# EAGLE design board3 (EAGLE 7.0.0)
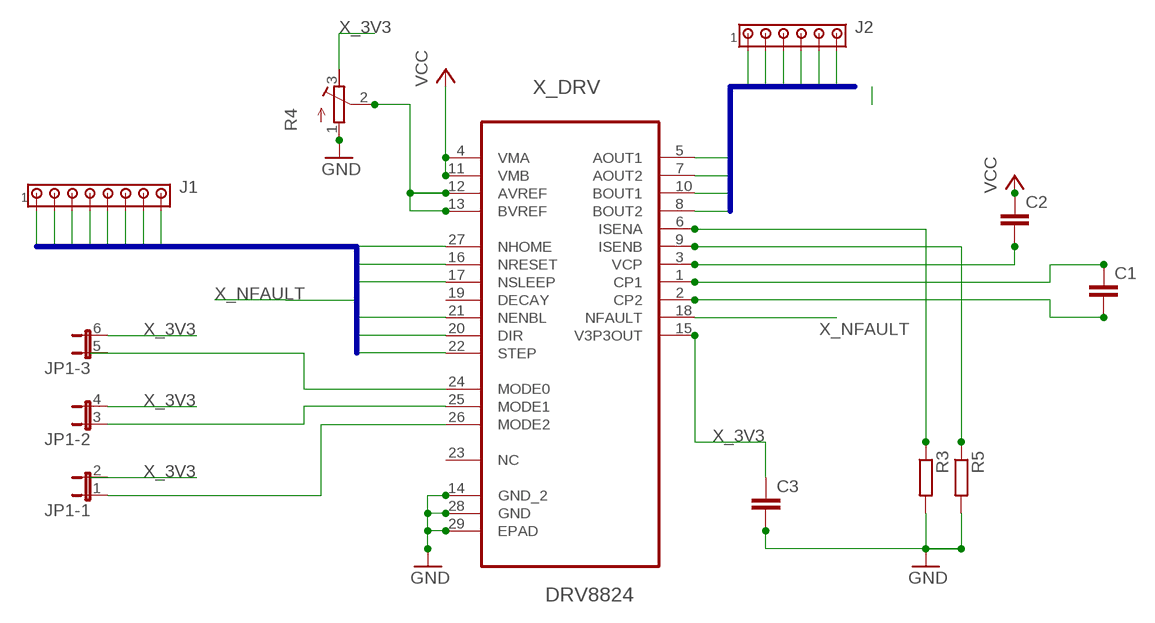
[diagram p0: schematic, sheet 1]

## Parts
C1  C-EU025-030X050  [C025-030X050]
C2  C-EU025-030X050  [C025-030X050]
C3  C-EU025-030X050  [C025-030X050]
J1  MTA08-100  [10X08MTA]
J2  MTA06-156  [1X6MTA]
JP1  JP3QE  [JP3Q]
R3  R-EU_0207/7  [0207/7]
R4  R-TRIMM64Y  [RTRIM64Y]
R5  R-EU_0207/7  [0207/7]
X_DRV  DRV8824  DRV8824PWPR  [SOP65P640X120-29N]

## Nets
GND [POWER]: C3.2 J1.8 J2.6 R3.2 R4.1(E) R5.2 X_DRV.14(GND_2) X_DRV.28(GND) X_DRV.29(EPAD)
N$1: JP1.1 X_DRV.26(MODE2)
N$2: JP1.3 X_DRV.25(MODE1)
N$3: X_DRV.24(MODE0)
N$9: R4.2(S) X_DRV.12(AVREF) X_DRV.13(BVREF)
N$10: C1.1 X_DRV.1(CP1)
N$11: C1.2 X_DRV.2(CP2)
N$12: C2.2 X_DRV.3(VCP)
N$19: R3.1 X_DRV.6(ISENA)
N$20: R5.1 X_DRV.9(ISENB)
VCC [POWER]: C2.1 J2.5 X_DRV.4(VMA) X_DRV.11(VMB)
X_3V3: C3.1 JP1.4 JP1.6 R4.3(A) X_DRV.15(V3P3OUT)
X_DIR: J1.2 X_DRV.20(DIR)
X_NENBL: J1.3 X_DRV.21(NENBL)
X_NFAULT: J1.7 X_DRV.18(NFAULT)
X_NHOME: J1.6 X_DRV.27(NHOME)
X_NRESET: J1.5 X_DRV.16(NRESET)
X_NSLEEP: J1.4 X_DRV.17(NSLEEP)
X_STEP: J1.1 X_DRV.22(STEP)
XOUT0: J2.1 X_DRV.5(AOUT1)
XOUT1: J2.2 X_DRV.7(AOUT2)
XOUT2: J2.3 J2.4 X_DRV.10(BOUT1)
XOUT3: X_DRV.8(BOUT2)
Unconnected: JP1.2 JP1.5 X_DRV.19(DECAY) X_DRV.23(NC)

## Buses
X_STEP,X_DIR,X_NENBL,X_NSLEEP,X_NRESET,X_NHOME,X_NFAULT,GND
XOUT[0..3],VCC,GND

## Library data of the parts
C1-C3 = resistor:C-EU: CAPACITOR, European symbol
J1 = con-amp:MTA08-100: AMP connector; OC_FARNELL: unknown; OC_NEWARK: unknown
J2 = con-amp:MTA06-156: AMP connector; OC_FARNELL: unknown; OC_NEWARK: unknown
JP1 = jumper:JP3QE: JUMPER
R3 R5 = resistor:R-EU_: RESISTOR, European symbol
R4 = resistor:R-TRIMM: Trimm resistor
X_DRV = ti_e14:DRV8824PWPR: STEPPER MOTOR CONTROLLER IC; MPN: DRV8824PWPR; OC_FARNELL: -; OC_NEWARK: 74R6336; PACKAGE: TSSOP-28; SUPPLIER: Texas Instruments

## Board
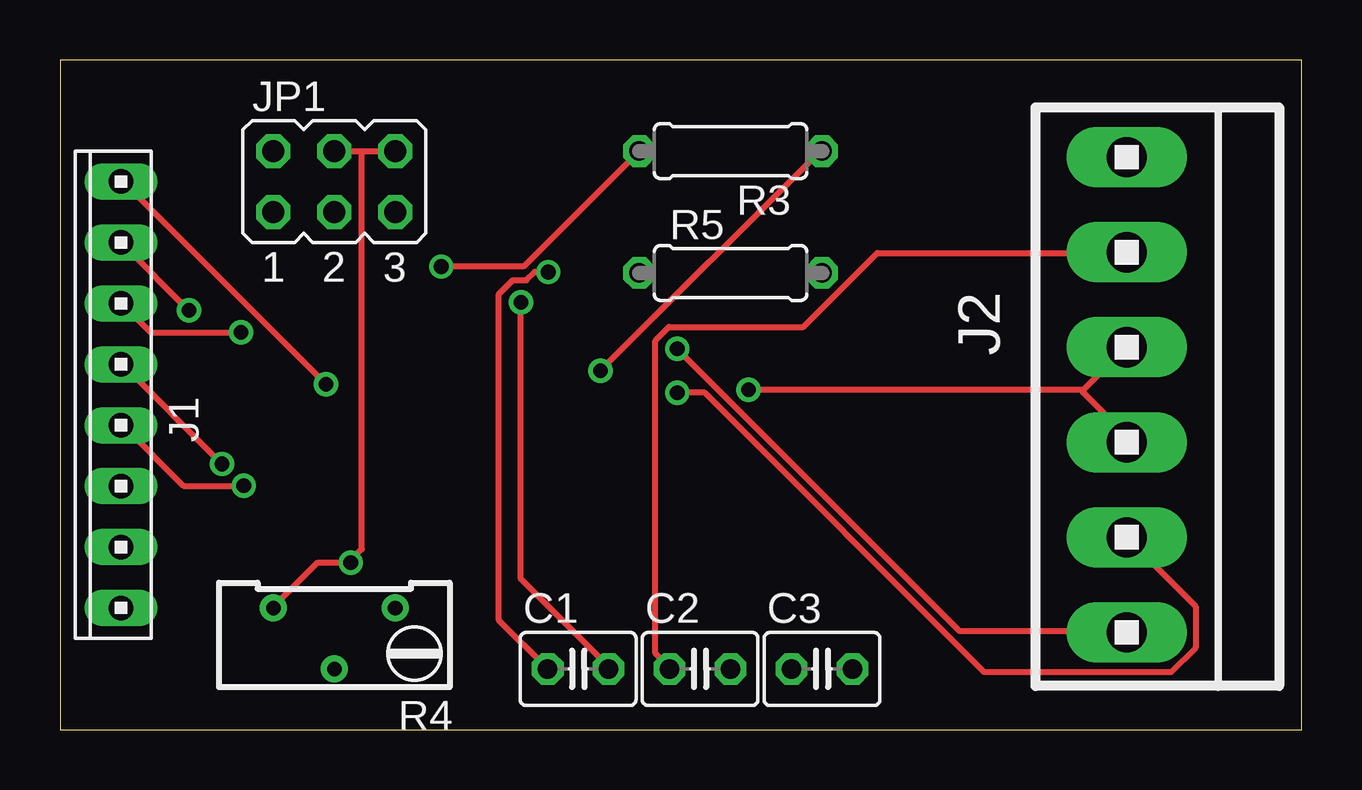
[diagram p1: board, top side]
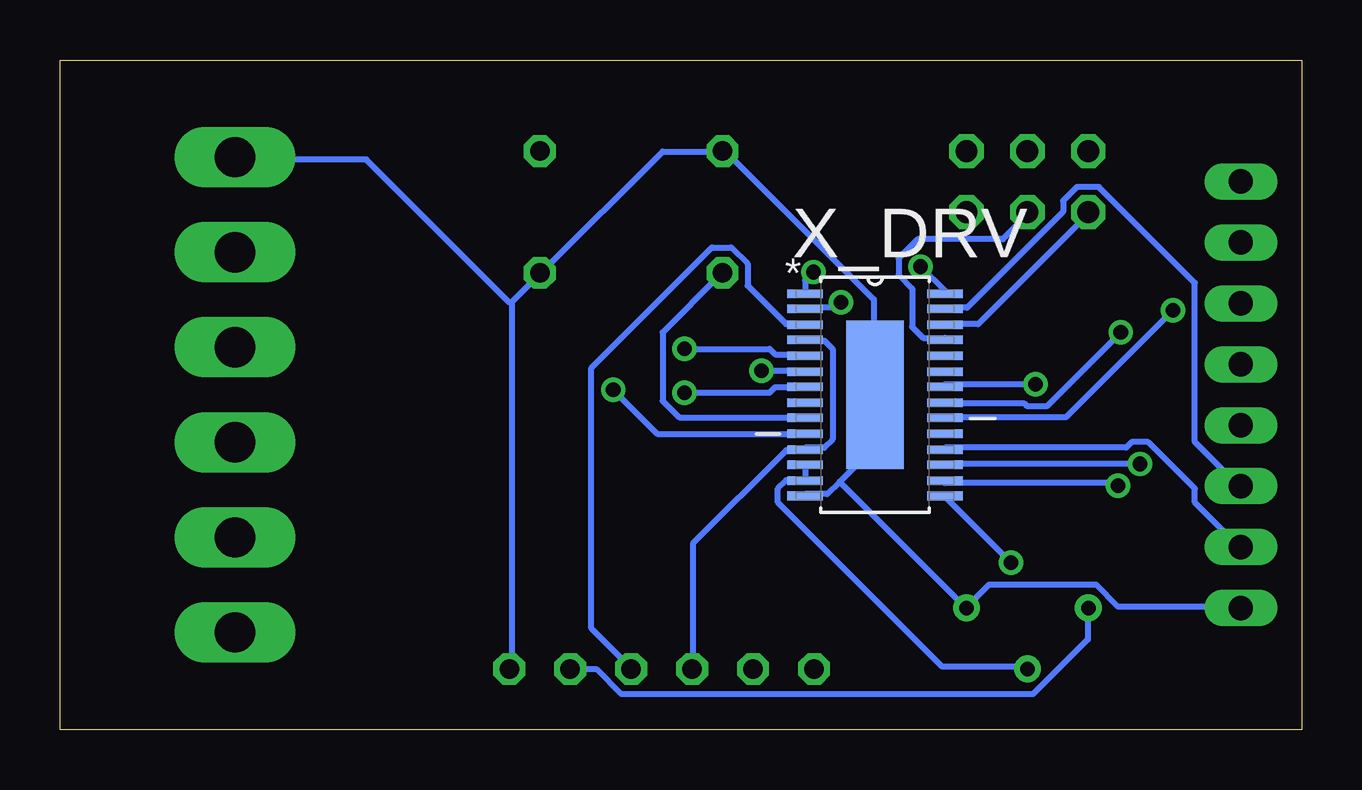
[diagram p2: board, bottom side, seen from below]

Size 51.74 x 27.93 mm. Coordinates in mm from the lower left corner, seen from the top.
Outline: 0,0 51.74,0 51.74,27.93 0,27.93 0,0
Copper layers (1*16): Top 0.035mm / dielectric 1.5mm / Bottom 0.035mm
Design rules "default": minimum track width 10mil, minimum drill 24mil, track to track 8mil, track to pad 8mil, pad to pad 8mil, via to via 8mil, smd to smd 8mil, copper to edge 40mil, drill to drill 8mil, minimum pad ring 10mil, minimum via ring 8mil, stop-mask expansion 4mil, vias tented up to drill 0mil, thermal gap 10mil

### Footprints (pad centres in the part's own frame; a part is rotated, then mirrored left to right if it is on the bottom)
C025-030X050 = drill 0.813 octagon: 1 -1.27,0; 2 1.27,0
10X08MTA = drill 1.016 long: 1 8.89,0; 2 6.35,0; 3 3.81,0; 4 1.27,0; 5 -1.27,0; 6 -3.81,0; 7 -6.35,0; 8 -8.89,0
1X6MTA = drill 1.676 long: 1 9.906,0; 2 5.944,0; 3 1.981,0; 4 -1.981,0; 5 -5.944,0; 6 -9.906,0
JP3Q = drill 0.914 octagon: 1 -2.54,-1.27; 2 -2.54,1.27; 3 0,-1.27; 4 0,1.27; 5 2.54,-1.27; 6 2.54,1.27
0207/7 = drill 0.813 octagon: 1 -3.81,0; 2 3.81,0
RTRIM64Y = drill 0.61: 1 0,-2.54; 2 -2.54,0; 3 0,2.54
SOP65P640X120-29N = smd 1.473 x 0.356: 1 -2.921,4.216; 2 -2.921,3.581; 3 -2.921,2.921; 4 -2.921,2.286; 5 -2.921,1.626; 6 -2.921,0.965; 7 -2.921,0.33; 8 -2.921,-0.33; 9 -2.921,-0.965; 10 -2.921,-1.626; 11 -2.921,-2.286; 12 -2.921,-2.921; 13 -2.921,-3.581; 14 -2.921,-4.216; 15 2.921,-4.216; 16 2.921,-3.581; 17 2.921,-2.921; 18 2.921,-2.286; 19 2.921,-1.626; 20 2.921,-0.965; 21 2.921,-0.33; 22 2.921,0.33; 23 2.921,0.965; 24 2.921,1.626; 25 2.921,2.286; 26 2.921,2.921; 27 2.921,3.581; 28 2.921,4.216 | smd 2.388 x 6.172: 29 0,0

### Placement (x,y rotation side)
C1  21.59,2.54 0 top
C2  26.67,2.54 0 top
C3  31.75,2.54 0 top
J1  2.54,13.97 90 top
J2  44.45,13.97 270 top
JP1  11.43,22.86 0 top
R3  27.94,24.13 180 top
R4  11.43,5.08 90 top
R5  27.94,19.05 0 top
X_DRV  17.78,13.97 0 bottom

### Tracks (layer width: path | path; a pad name or v marks a point on that pad's centre or on a via)
GND  (via drill 0.61)
  Top 0.254: v15.89,19.32 19.32,19.32 24.12,24.12 R3.2
  Bottom 0.254: 19.26,10.34 17.83,11.77 17.83,13.95 X_DRV.29 17.83,14.06 17.83,17.95 24,24.12 R3.2 24.23,24.12 26.63,24.12 31.66,19.09 R5.2 31.77,18.97 32.92,17.83 | 19.26,10.34 19.77,9.83 20.69,9.83 X_DRV.14 | 19.26,10.34 19.2,10.29 14.06,5.14 R4.1 13.95,5.14 13.03,6.06 8.57,6.06 7.66,5.14 2.63,5.14 J1.8 | v15.89,19.32 14.86,18.29 X_DRV.28 | 32.92,17.83 32.92,2.63 C3.2 | J2.6 44.35,23.77 38.98,23.77 33.03,17.83 32.92,17.83
N$1
  Bottom 0.254: X_DRV.26 14.86,16.92 13.49,16.92 8.91,21.49 JP1.1
N$2
  Bottom 0.254: X_DRV.25 14.86,16.34 15.77,16.34 16.23,16.8 16.23,18.4 16.8,18.97 16.8,19.66 16,20.46 12.46,20.46 11.43,21.49 JP1.3
N$9
  Bottom 0.254: X_DRV.12 20.69,10.97 20.69,10.4 X_DRV.13 20.8,10.4 21.49,10.4 21.83,10.06 21.83,9.49 14.97,2.63 11.43,2.63 R4.2
N$10  (via drill 0.61)
  Top 0.254: v20.34,19.09 19.77,19.09 19.43,18.75 18.86,18.75 18.29,18.17 18.29,4.57 20.23,2.63 C1.1
  Bottom 0.254: v20.34,19.09 20.69,18.75 20.69,18.29 X_DRV.1
N$11  (via drill 0.61)
  Top 0.254: v19.2,17.83 19.2,6.29 22.86,2.63 C1.2
  Bottom 0.254: v19.2,17.83 19.43,17.6 20.69,17.6 X_DRV.2
N$12
  Bottom 0.254: X_DRV.3 20.8,16.92 21.49,16.92 23.09,18.52 23.09,19.43 23.77,20.12 24.57,20.12 29.6,15.09 29.6,4.23 28,2.63 C2.2
N$19  (via drill 0.61)
  Top 0.254: v22.52,14.97 31.66,24.12 R3.1
  Bottom 0.254: v22.52,14.97 20.8,14.97 X_DRV.6
N$20
  Bottom 0.254: X_DRV.9 20.8,13.03 25.95,13.03 26.63,13.72 26.63,16.57 24.23,18.97 R5.1
VCC
  Top 0.254: J2.5 44.35,19.89 34.06,19.89 30.98,16.8 25.38,16.8 24.8,16.23 24.8,3.2 25.38,2.63 C2.1
  Bottom 0.254: X_DRV.4 20.69,16.23 19.89,16.23 19.55,15.89 19.55,12.12 19.89,11.77 20.69,11.77 X_DRV.11 20.8,11.66 21.49,11.66 25.38,7.77 25.38,2.63 C2.1
X_3V3  (via drill 0.61)
  Top 0.254: 12.57,24.12 13.95,24.12 JP1.6 | 12.57,24.12 11.43,24.12 JP1.4 | R4.3 8.91,5.14 10.74,6.97 v12.12,6.97 12.12,7.09 12.57,7.54 12.57,24 12.57,24.12
  Bottom 0.254: v12.12,6.97 14.86,9.72 X_DRV.15 | C3.1 30.4,2.52 29.38,2.52 28.35,1.49 11.2,1.49 8.91,3.77 8.91,5.03 R4.3
X_DIR  (via drill 0.61)
  Top 0.254: v5.37,17.49 2.63,20.23 J1.2
  Bottom 0.254: v5.37,17.49 9.83,13.03 14.86,13.03 X_DRV.20
X_NENBL  (via drill 0.61)
  Top 0.254: v7.54,16.57 3.77,16.57 2.63,17.72 J1.3
  Bottom 0.254: v7.54,16.57 10.63,13.49 11.43,13.49 11.54,13.6 14.86,13.6 X_DRV.21
X_NFAULT
  Bottom 0.254: X_DRV.18 14.86,11.77 7.32,11.77 7.09,12 6.4,12 4.46,10.06 4.46,9.49 2.63,7.66 J1.7
X_NHOME
  Bottom 0.254: X_DRV.27 14.86,17.6 13.95,17.6 9.94,21.6 9.94,22.06 9.37,22.63 8.46,22.63 4.46,18.63 4.46,12 2.63,10.17 J1.6
X_NRESET  (via drill 0.61)
  Top 0.254: v7.66,10.17 5.14,10.17 2.63,12.69 J1.5
  Bottom 0.254: v7.66,10.17 7.77,10.29 14.86,10.29 X_DRV.16
X_NSLEEP  (via drill 0.61)
  Top 0.254: v6.74,11.09 2.63,15.2 J1.4
  Bottom 0.254: v6.74,11.09 14.86,11.09 X_DRV.17
X_STEP  (via drill 0.61)
  Top 0.254: v11.09,14.4 2.63,22.86 J1.1
  Bottom 0.254: v11.09,14.4 14.86,14.4 X_DRV.22
XOUT0  (via drill 0.61)
  Top 0.254: v25.72,15.89 37.49,4.12 44.35,4.12 J2.1
  Bottom 0.254: v25.72,15.89 22.17,15.89 21.95,15.66 20.8,15.66 X_DRV.5
XOUT1  (via drill 0.61)
  Top 0.254: v25.72,14.06 26.86,14.06 38.52,2.4 46.29,2.4 47.32,3.43 47.32,5.14 44.46,8 J2.2
  Bottom 0.254: v25.72,14.06 22.17,14.06 21.95,14.29 20.8,14.29 X_DRV.7
XOUT2  (via drill 0.61)
  Top 0.254: 42.63,14.17 v28.69,14.17 | 42.63,14.17 44.35,15.89 J2.4 | J2.3 44.35,12 44.35,12.34 42.63,14.06 42.63,14.17
  Bottom 0.254: v28.69,14.17 26.86,12.34 20.8,12.34 X_DRV.10